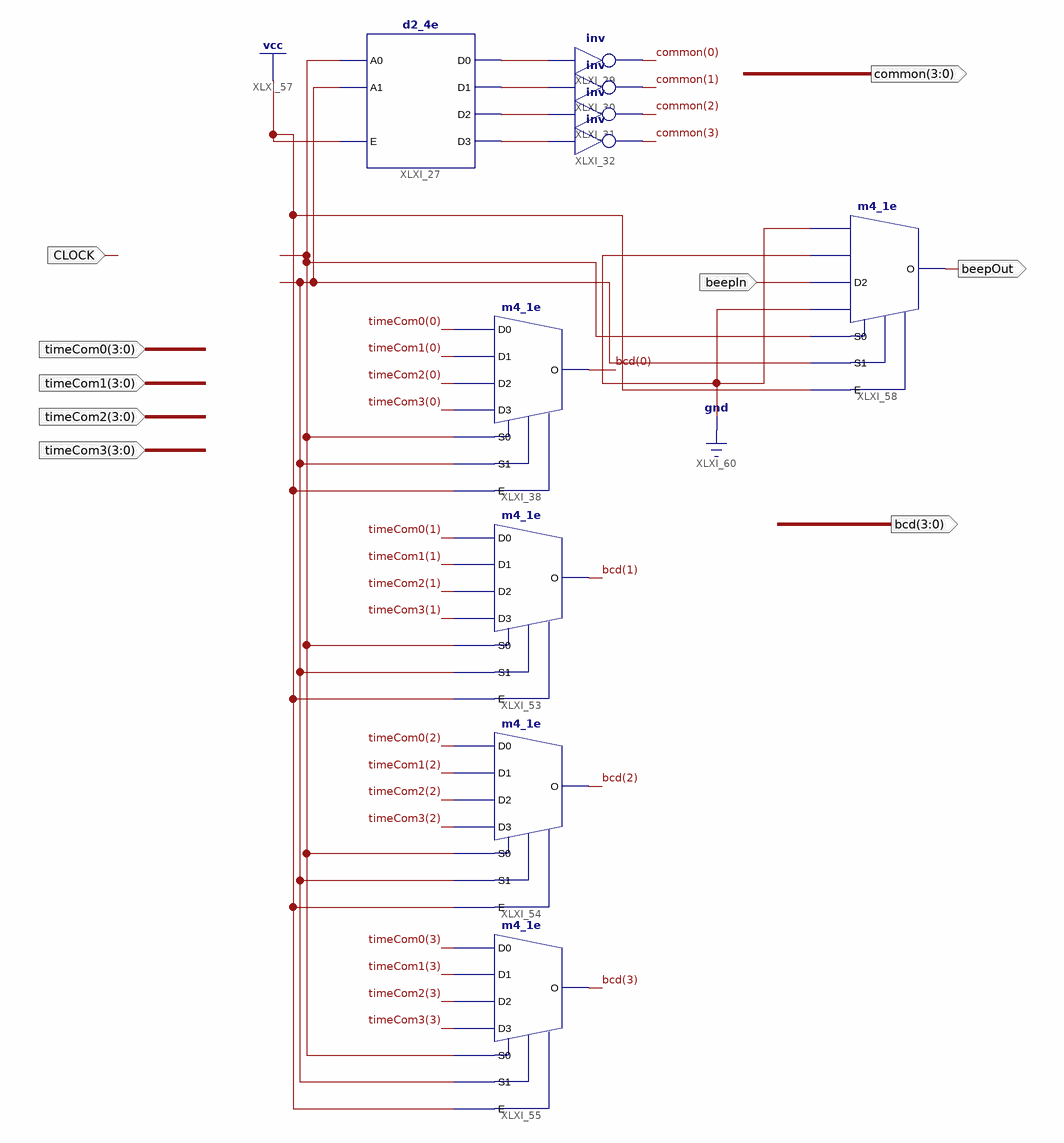
[diagram p0: schematic sheet 1]
// Xilinx ISE schematic myMultiplexer.sch (spartan6) as structural Verilog: 10 symbols, 9 ports
module myMultiplexer (
  input  CLOCK,
  input  [3:0] timeCom0,
  input  [3:0] timeCom1,
  input  [3:0] timeCom2,
  input  [3:0] timeCom3,
  input  beepIn,
  output [3:0] common,
  output [3:0] bcd,
  output beepOut
);

  wire XLXN_43, XLXN_44, XLXN_45, XLXN_46, XLXN_166, XLXN_172;

  d2_4e XLXI_27 (.A0(XLXN_166), .A1(XLXN_172), .E(1'b1), .D0(XLXN_43), .D1(XLXN_44), .D2(XLXN_45), .D3(XLXN_46));
  not XLXI_29 (common[0], XLXN_43);
  not XLXI_30 (common[1], XLXN_44);
  not XLXI_31 (common[2], XLXN_45);
  not XLXI_32 (common[3], XLXN_46);
  m4_1e XLXI_53 (
    .D0(timeCom0[1]), .D1(timeCom1[1]), .D2(timeCom2[1]), .D3(timeCom3[1]), .E(1'b1), .S0(XLXN_166),
    .S1(XLXN_172), .O(bcd[1]));
  m4_1e XLXI_54 (
    .D0(timeCom0[2]), .D1(timeCom1[2]), .D2(timeCom2[2]), .D3(timeCom3[2]), .E(1'b1), .S0(XLXN_166),
    .S1(XLXN_172), .O(bcd[2]));
  m4_1e XLXI_55 (
    .D0(timeCom0[3]), .D1(timeCom1[3]), .D2(timeCom2[3]), .D3(timeCom3[3]), .E(1'b1), .S0(XLXN_166),
    .S1(XLXN_172), .O(bcd[3]));
  m4_1e XLXI_38 (
    .D0(timeCom0[0]), .D1(timeCom1[0]), .D2(timeCom2[0]), .D3(timeCom3[0]), .E(1'b1), .S0(XLXN_166),
    .S1(XLXN_172), .O(bcd[0]));
  m4_1e XLXI_58 (.D0(1'b0), .D1(1'b0), .D2(beepIn), .D3(1'b0), .E(1'b1), .S0(XLXN_166), .S1(XLXN_172), .O(beepOut));
endmodule
